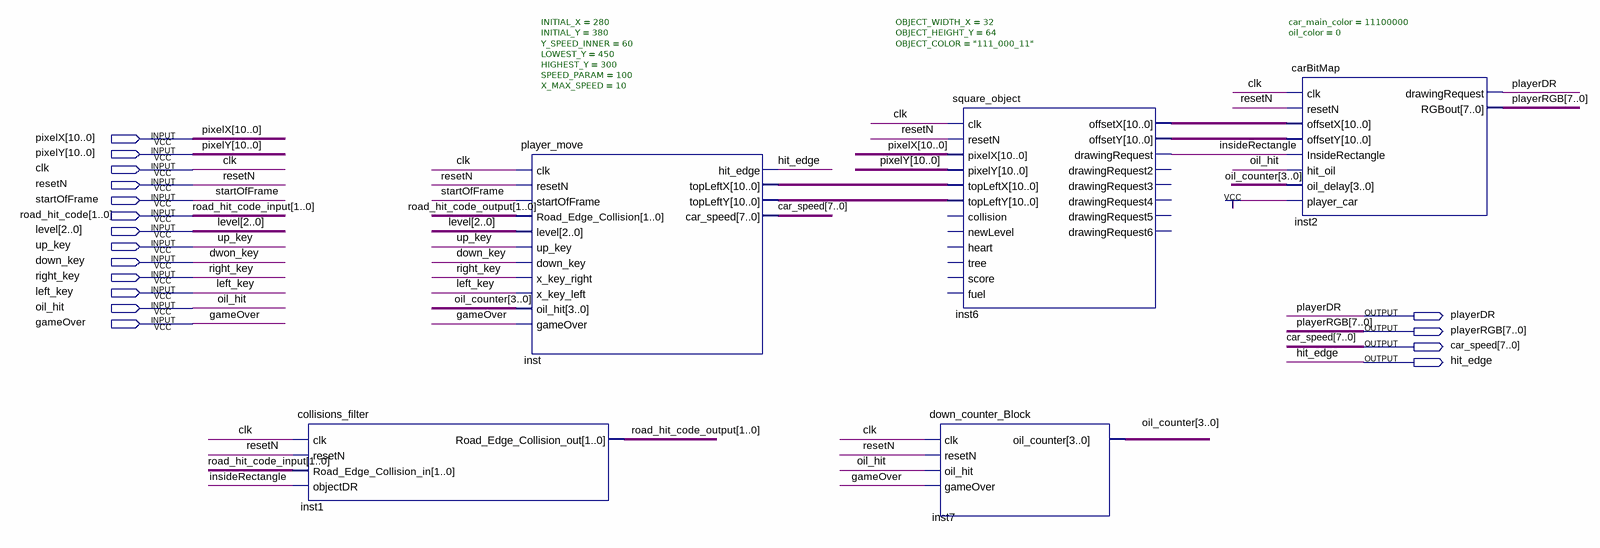
[diagram p0: schematic sheet]
// Quartus schematic player_Block.bdf as structural Verilog: 5 symbols, 17 pins
module player_Block (
  input  [10:0] pixelX,
  input  [10:0] pixelY,
  input  clk,
  input  resetN,
  input  startOfFrame,
  input  [1:0] road_hit_code,
  input  [2:0] level,
  input  up_key,
  input  down_key,
  input  right_key,
  input  left_key,
  input  oil_hit,
  input  gameOver,
  output playerDR,
  output [7:0] playerRGB,
  output [7:0] car_speed,
  output hit_edge
);

  wire insideRectangle;
  wire [1:0] road_hit_code_output;
  wire [3:0] oil_counter;
  wire [10:0] inst6_offsetx, inst6_offsety, inst_topleftx, inst_toplefty;

  collisions_filter inst1 (
    .clk(clk), .resetN(resetN), .Road_Edge_Collision_in(road_hit_code), .objectDR(insideRectangle),
    .Road_Edge_Collision_out(road_hit_code_output));
  player_move #(.INITIAL_X(280), .INITIAL_Y(380), .Y_SPEED_INNER(60), .LOWEST_Y(450), .HIGHEST_Y(300), .SPEED_PARAM(100), .X_MAX_SPEED(10)) inst (
    .clk(clk), .resetN(resetN), .startOfFrame(startOfFrame), .Road_Edge_Collision(road_hit_code_output),
    .level(level), .up_key(up_key), .down_key(down_key), .x_key_right(right_key), .x_key_left(left_key),
    .oil_hit(oil_counter), .gameOver(gameOver), .hit_edge(hit_edge), .topLeftX(inst_topleftx),
    .topLeftY(inst_toplefty), .car_speed(car_speed));
  square_object #(.OBJECT_WIDTH_X(32), .OBJECT_HEIGHT_Y(64), .OBJECT_COLOR("111_000_11")) inst6 (
    .clk(clk), .resetN(resetN), .pixelX(pixelX), .pixelY(pixelY), .topLeftX(inst_topleftx),
    .topLeftY(inst_toplefty), .offsetX(inst6_offsetx), .offsetY(inst6_offsety),
    .drawingRequest(insideRectangle));  // open: collision, newLevel, heart, tree, score, fuel, drawingRequest2, drawingRequest3, drawingRequest4, drawingRequest5, drawingRequest6
  down_counter_Block inst7 (
    .clk(clk), .resetN(resetN), .oil_hit(oil_hit), .gameOver(gameOver), .oil_counter(oil_counter));
  carBitMap #(.car_main_color(11100000), .oil_color(0)) inst2 (
    .clk(clk), .resetN(resetN), .offsetX(inst6_offsetx), .offsetY(inst6_offsety),
    .InsideRectangle(insideRectangle), .hit_oil(oil_hit), .oil_delay(oil_counter), .player_car(1'b1),
    .drawingRequest(playerDR), .RGBout(playerRGB));

  // Other names for the same wires on the sheet: dwon_key = down_key; road_hit_code_input[1:0] = road_hit_code
endmodule
